# EAGLE design SkyKontrol-watchdog (EAGLE 9.6.2)
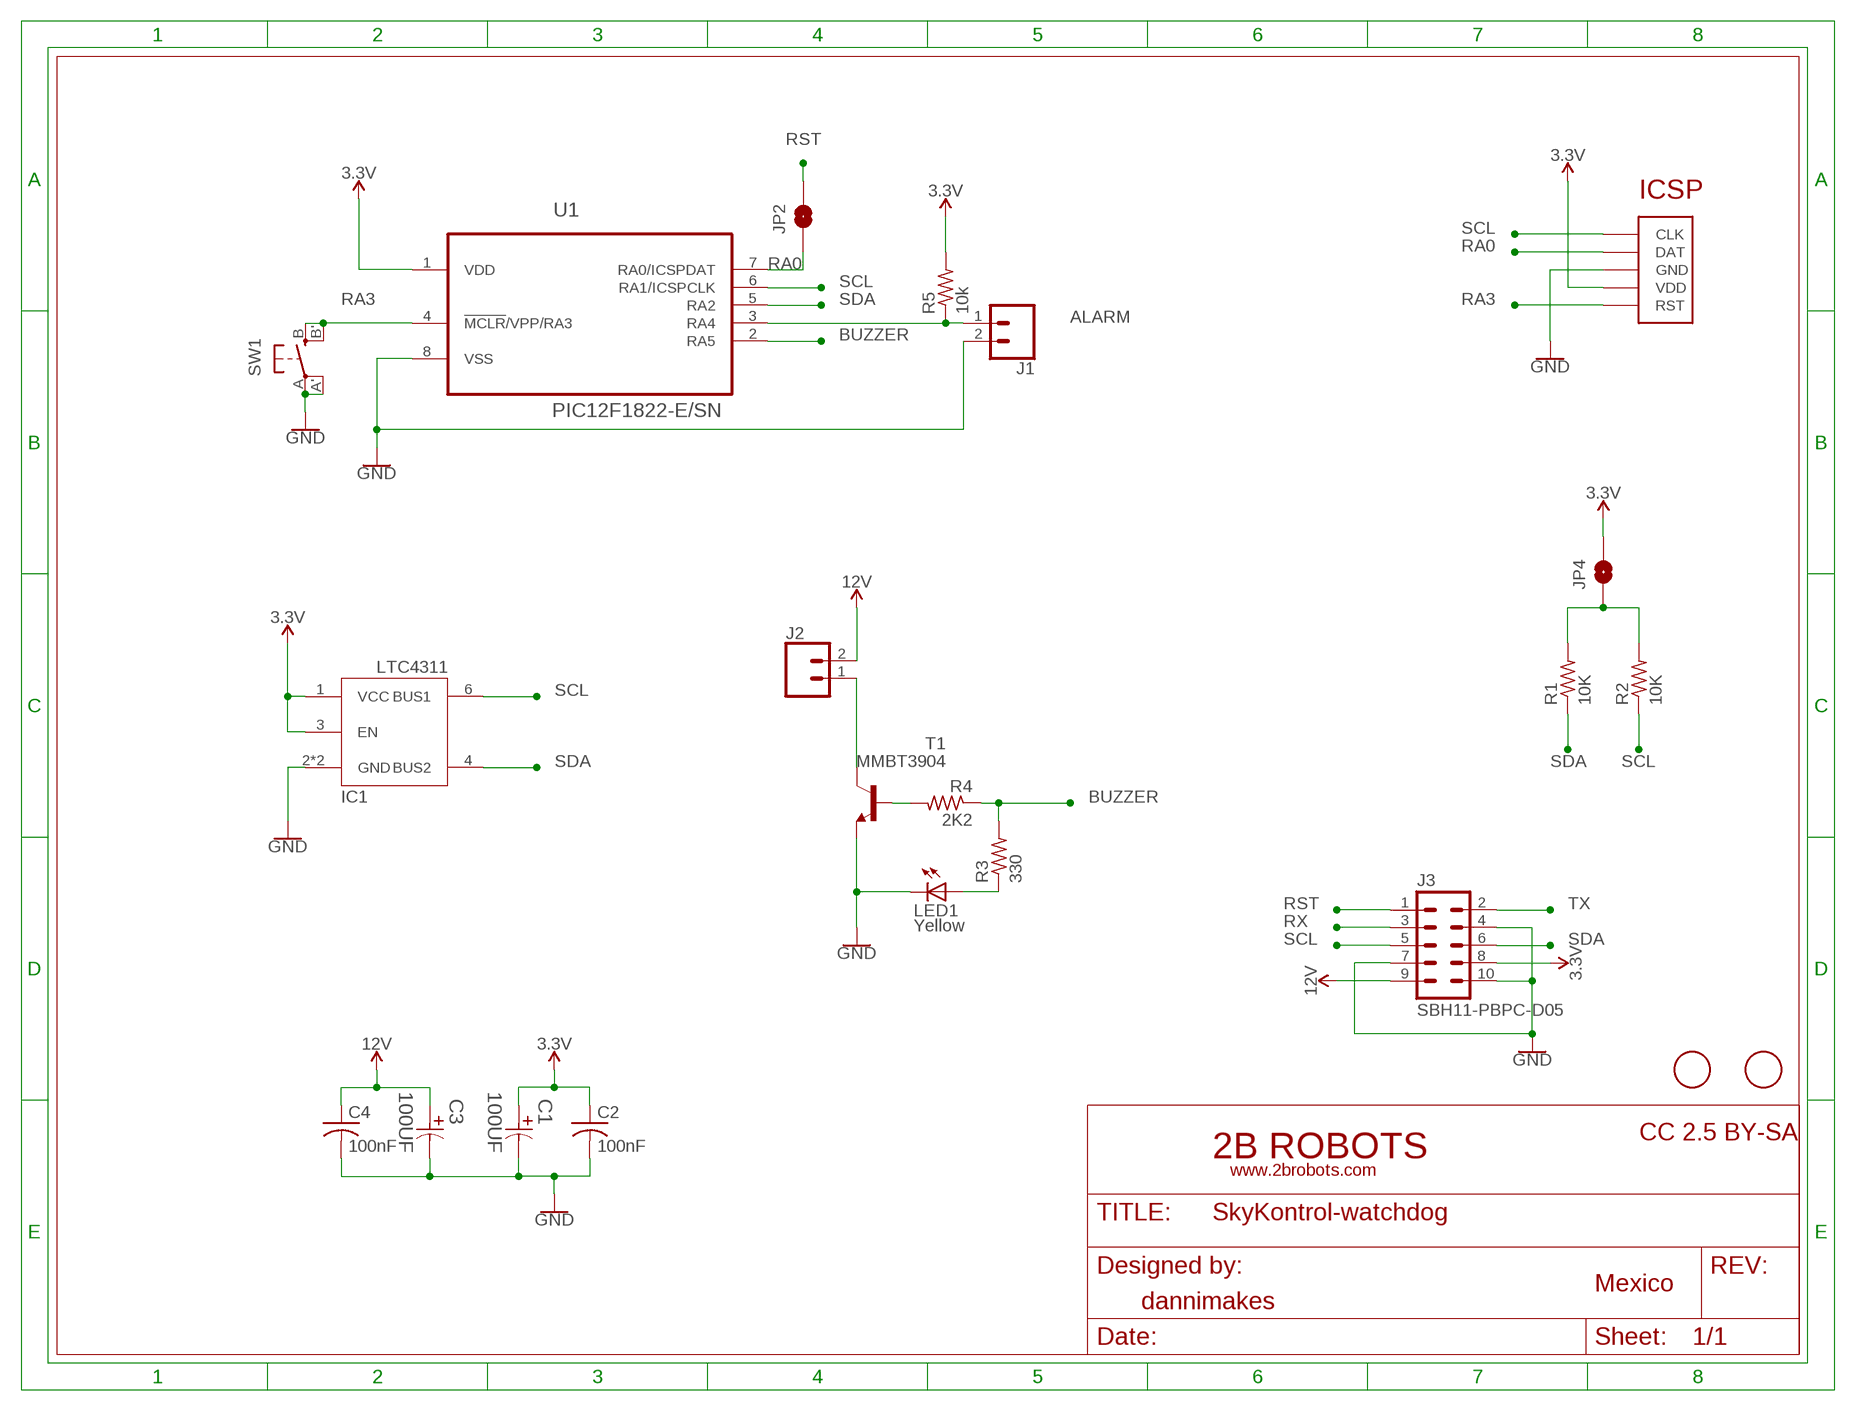
[diagram p0: schematic, sheet 1]

## Parts
C1  100UF  EEE-HA1E101XP-CASE-D8  [CAPAE660X800N]
C2  100nF  C-USC0603K  [C0603K]
C3  100UF  EEE-HA1E101XP-CASE-D8  [CAPAE660X800N]
C4  100nF  C-USC0603K  [C0603K]
IC1  LTC4311_SC70  [SC70-6L]
J1  CONN_025MM  [SCREWTERMINAL-5MM-2]
J2  CONN_025MM  [SCREWTERMINAL-5MM-2]
J3  SBH11-PBPC-D05  [SBH11-PBPC-D05]
JP2  JUMPER-SMT_2_NO_SILK  [SMT-JUMPER_2_NO_SILK]
JP4  JUMPER-SMT_2_NO_SILK  [SMT-JUMPER_2_NO_SILK]
LED1  Yellow  LEDCHIPLED_1206  [CHIPLED_1206]
R1  10K  R-US_R0805  [R0805]
R2  10K  R-US_R0805  [R0805]
R3  330  R-US_R0805  [R0805]
R4  2K2  R-US_R0805  [R0805]
R5  10k  R-US_R0805  [R0805]
SW1  SPST_TACT-EVQQ2  [EVQ-Q2]
T1  MMBT3904  MMBT3904LT1-NPN-SOT23-BEC  [SOT23-BEC]
U1  PIC12F1822-E/SN  [SOIC127P600X175-8N]
U$1  FIDUCIAL  [FIDUCIAL_1MM]
U$2  ICSP_POGO  [ICSP_POGO]
U$3  FIDUCIAL  [FIDUCIAL_1MM]

## Nets
3.3V: C1.1 C2.1 IC1.1(VCC) IC1.3(EN) J3.8 JP4.2 R5.2 U1.1(VDD) U$2.P$2(VDD)
12V: C3.1 C4.1 J2.2 J3.9
ALARM: J1.1 R5.1 U1.3(RA4)
BUZZER: R3.2 R4.1 U1.2(RA5)
GND: C1.2 C2.2 C3.2 C4.2 IC1.2(GND) IC1.5(GND) J1.2 J3.4 J3.7 J3.10 LED1.C SW1.A'(P1) SW1.A(P) T1.E U1.8(VSS) U$2.P$3(GND)
N$1: LED1.A R3.1
N$2: J2.1 T1.C
N$8: JP4.1 R1.2 R2.2
N$12: R4.2 T1.B
RA0: JP2.1 U1.7(RA0/ICSPDAT) U$2.P$4(DAT)
RA3: SW1.B'(S1) SW1.B(S) U1.4(!MCLR!/VPP/RA3) U$2.P$1(RST)
RST: J3.1 JP2.2
RX: J3.3
SCL: IC1.6(BUS1) J3.5 R2.1 U1.6(RA1/ICSPCLK) U$2.P$5(CLK)
SDA: IC1.4(BUS2) J3.6 R1.1 U1.5(RA2)
TX: J3.2

## Library data of the parts
C1 C3 = Panasonic-EEEFT_EEEH:EEE-: Aluminum Electrolytic Capacitors,Surface Mount Type; MPN: EEE-HA1E101XP; OC_FARNELL: 1973328; OC_NEWARK: 58T9236; PACKAGE: CASE-D8; SUPPLIER: PANASONIC; TOLERANCE: ±20 %; VOLTAGERATING: 25V
C2 C4 = adafruit:C-US: CAPACITOR, American symbol
IC1 = LTC4311:LTC4311
J1 J2 = SparkFun-Connectors:CONN_02: Multi connection point. Often used as Generic Header-pin footprint for 0.1 inch spaced/style header connections On any of the 0.1 inch spaced packages, you can populate with these: Break Away Headers - Straight <https://www.sparkfun.com/products/116> (PRT-00116) Break Away Male Headers - Right Angle <https://www.sparkfun.com/products/553> (PRT-00553) Female Headers <https://www.sparkfun.com/products/115> (PRT-00115) Break Away Headers - Machine Pin <https://www.sparkfun.com/products/117> (PRT-00117) Break Away Female Headers - Swiss Machine Pin <https://www.sparkfun.com/products/743> (PRT-00743) For SCREWTERMINALS and SPRING TERMINALS visit here: Screw Terimnals on SparkFun.com <https://www.sparkfun.com/search/results?term=Screw+Terminals> (5mm/3.5mm/2.54mm spacing) This device is also useful as a general connection point to wire up your design to another part of your project. Our various solder wires solder well into these plated through hole pads. Hook-Up Wire - Assortment (Stranded, 22 AWG) <https://www.sparkfun.com/products/11375> (PRT-11375) Hook-Up Wire - Assortment (Solid Core, 22 AWG) <https://www.sparkfun.com/products/11367> (PRT-11367) View the entire wire category on our website here <https://www.sparkfun.com/categories/141> Special notes: Molex polarized connector foot print use with: PRT-08233 with associated crimp pins and housings. 2.54_SCREWTERM for use with PRT-10571. 3.5mm Screw Terminal footprints for PRT-08084 5mm Screw Terminal footprints for use with PRT-08432; SF_SKU: PRT-08432
J3 = con-sullins:SBH11-PBPC-D05: HEADER - Vertical, Shrouded
JP2 JP4 = SparkFun-Jumpers:JUMPER-SMT_2_NO: Normally open jumper This jumper has two pads in close proximity to each other. Apply solder to close the connection. Round pads are easier to solder for beginners, but are a lot larger. SparkFun Product that uses the round pads: SparkFun EL Sequencer <https://www.sparkfun.com/products/12781>
LED1 = adafruit:LED: LED OSRAM: - CHIPLED LG R971, LG N971, LY N971, LG Q971, LY Q971, LO R971, LY R971 LH N974, LH R974 LS Q976, LO Q976, LY Q976 LO Q996 - Hyper CHIPLED LW Q18S LB Q993, LB Q99A, LB R99A - SideLED LS A670, LO A670, LY A670, LG A670, LP A670 LB A673, LV A673, LT A673, LW A673 LH A674 LY A675 LS A676, LA A676, LO A676, LY A676, LW A676 LS A679, LY A679, LG A679 - Hyper Micro SIDELED® LS Y876, LA Y876, LO Y876, LY Y876 LT Y87S - SmartLED LW L88C, LW L88S LB L89C, LB L89S, LG L890 LS L89K, LO L89K, LY L89K LS L896, LA L896, LO L896, LY L896 - TOPLED LS T670, LO T670, LY T670, LG T670, LP T670 LSG T670, LSP T670, LSY T670, LOP T670, LYG T670 LG T671, LOG T671, LSG T671 LB T673, LV T673, LT T673, LW T673 LH T674 LS T676, LA T676, LO T676, LY T676, LB T676, LH T676, LSB T676, LW T676 LB T67C, LV T67C, LT T67C, LS T67K, LO T67K, LY T67K, LW E67C LS E67B, LA E67B, LO E67B, LY E67B, LB E67C, LV E67C, LT E67C LW T67C LS T679, LY T679, LG T679 LS T770, LO T770, LY T770, LG T770, LP T770 LB T773, LV T773, LT T773, LW T773 LH T774 LS E675, LA E675, LY E675, LS T675 LS T776, LA T776, LO T776, LY T776, LB T776 LHGB T686 LT T68C, LB T68C - Hyper Mini TOPLED® LB M676 - Mini TOPLED Santana® LG M470 LS M47K, LO M47K, LY M47K Source: http://www.osram.convergy.de/
R1-R5 = adafruit:R-US_: RESISTOR, American symbol
SW1 = adafruit:SPST_TACT: SMT 6mm switch, EVQQ2 series http://www.ladyada.net/library/eagle
T1 = transistor:*-NPN-: NPN Transistror BF959 corrected 2008.03.06
U1 = Microchip-PIC12F1822-E_SN:PIC12F1822-E/SN: 8/14-Pin Flash Microcontrollers,SOIC-8; MPN: PIC12F1822-E/SN; OC_FARNELL: 2315760; OC_NEWARK: 53R0195; PACKAGE: SOIC-8; SUPPLIER: Microchip
U$1 U$3 = adafruit:FIDUCIAL: For use by pick and place machines to calibrate the vision/machine, 1mm By microbuilder.eu
U$2 = ICSP_POGO:ICSP_POGO

## Board
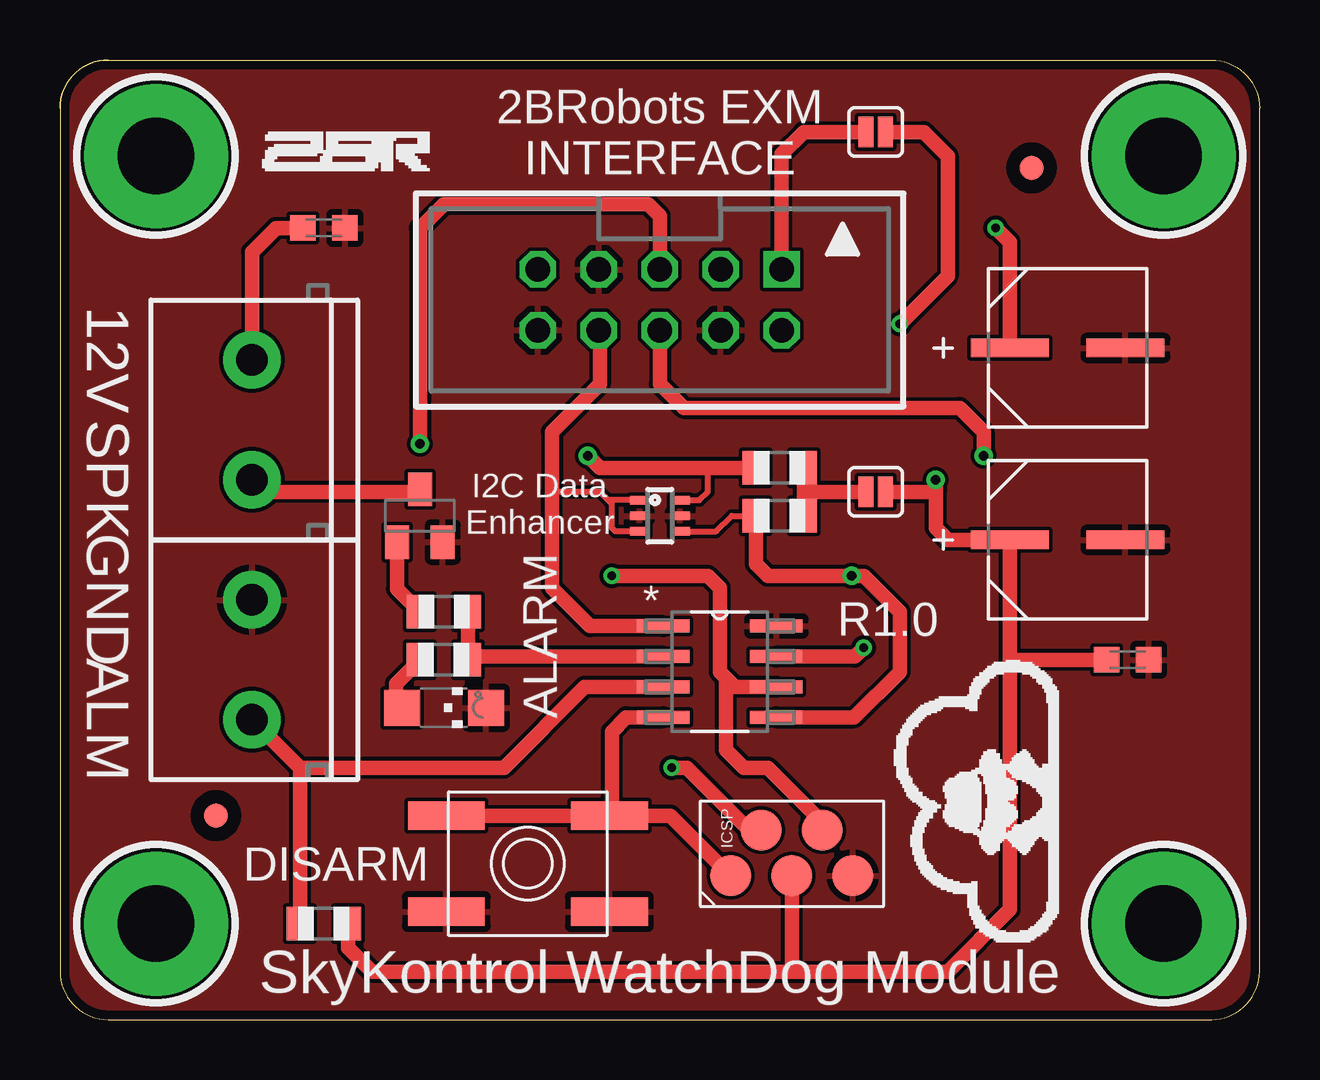
[diagram p1: board, top side]
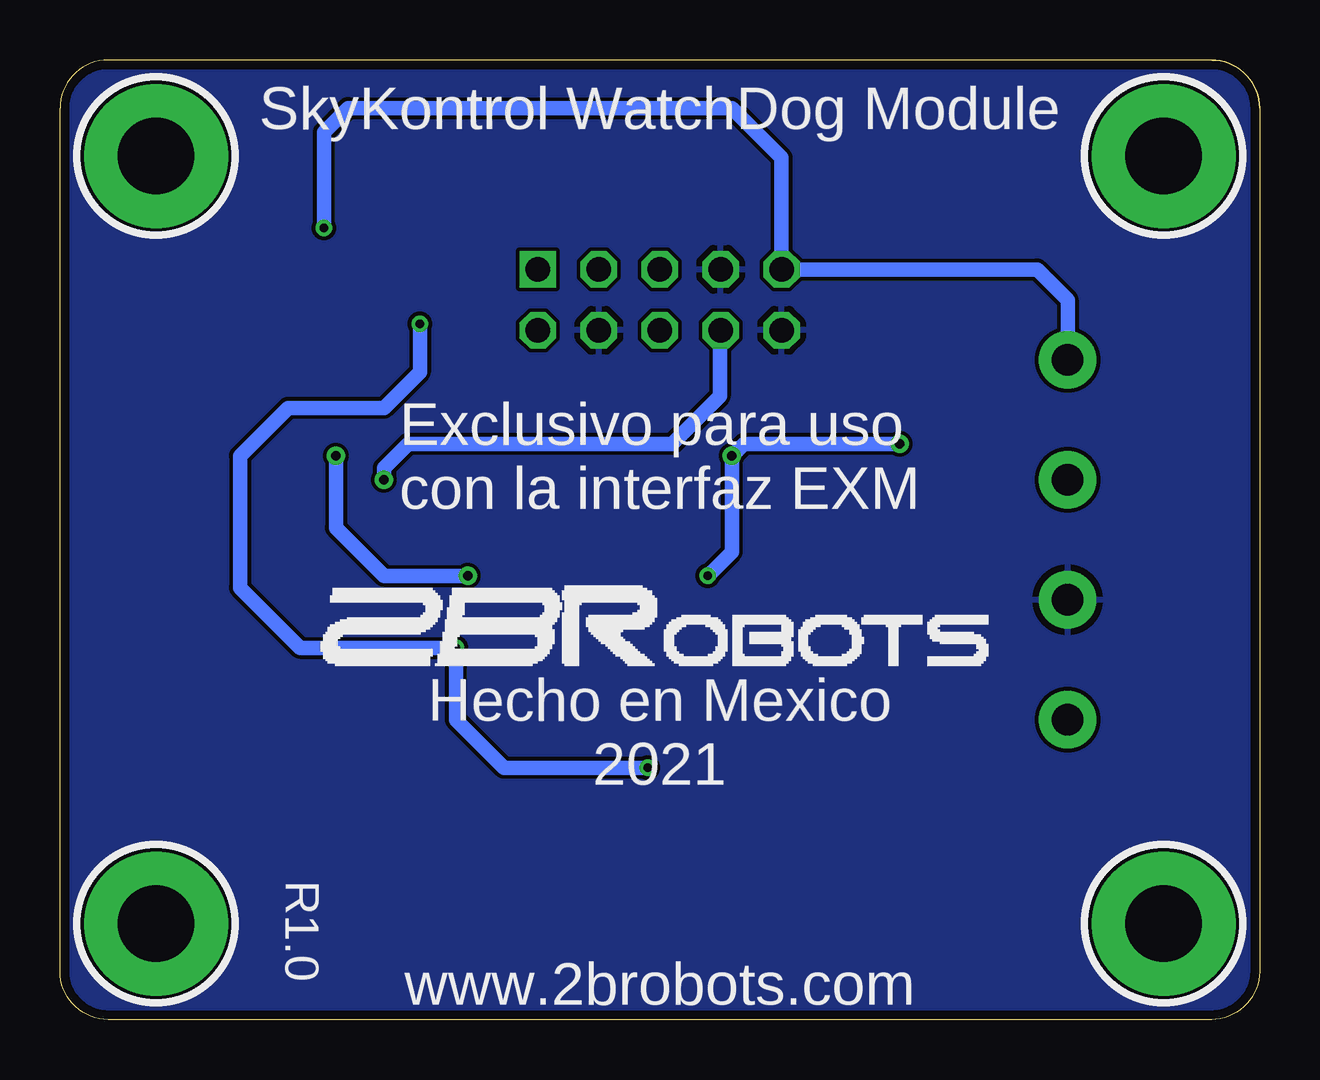
[diagram p2: board, bottom side, seen from below]

Size 50 x 40 mm. Coordinates in mm from the lower left corner, seen from the top.
Outline: 0,38 0,2 arc90 2,0 48,0 arc90 50,2 50,38 arc90 48,40 2,40
Outline: 2,40 arc90 0,38
Outline: 0,38 arc-90 2,40
Copper layers (1*16): Top 0.0356mm / dielectric 1.5011mm / Bottom 0.0356mm
Design rules "2brobots-2layer": minimum track width 6mil, minimum drill 0.3mm, track to track 6mil, track to pad 6mil, pad to pad 6mil, via to via 6mil, smd to smd 6mil, copper to edge 15mil, drill to drill 6mil, minimum pad ring 7mil, minimum via ring 7mil, stop-mask expansion 2.5mil, vias tented up to drill 50mil, thermal gap 10mil

### Footprints (pad centres in the part's own frame; a part is rotated, then mirrored left to right if it is on the bottom)
CAPAE660X800N = smd 3.251 x 0.762: 1 -2.413,0; 2 2.413,0
C0603K = smd 1.05 x 1.08: 1 -0.875,0; 2 0.875,0
SC70-6L = smd 0.35 x 0.8: 1 -0.65,-0.85; 2 0,-0.85; 3 0.65,-0.85; 4 0.65,0.85; 5 0,0.85; 6 -0.65,0.85
SCREWTERMINAL-5MM-2 = drill 1.3 pad 2.413: 1 -2.5,0; 2 2.5,0
SBH11-PBPC-D05 = drill 1.016 square: 1 -5.08,-1.27 | drill 1.016 octagon: 2 -5.08,1.27; 3 -2.54,-1.27; 4 -2.54,1.27; 5 0,-1.27; 6 0,1.27; 7 2.54,-1.27; 8 2.54,1.27; 9 5.08,-1.27; 10 5.08,1.27
SMT-JUMPER_2_NO_SILK = smd 0.635 x 1.27: 1 -0.406,0; 2 0.406,0
CHIPLED_1206 = smd 1.5 x 1.5: A 0,-1.75; C 0,1.75
R0805 = smd 1.1 x 1.4: 1 -1,0; 2 1,0
EVQ-Q2 = smd 3.2 x 1.2: A -3.4,-2; A' 3.4,-2; B -3.4,2; B' 3.4,2
SOT23-BEC = smd 1 x 1.4: B -0.95,-1.1; C 0,1.1; E 0.95,-1.1
SOIC127P600X175-8N = smd 2.184 x 0.559: 1 -2.362,1.905; 2 -2.362,0.635; 3 -2.362,-0.635; 4 -2.362,-1.905; 5 2.362,-1.905; 6 2.362,-0.635; 7 2.362,0.635; 8 2.362,1.905
FIDUCIAL_1MM = smd 1 x 1: 1 0,0
ICSP_POGO = smd 1.7 x 1.7: P$1 -2.55,0; P$2 0,0; P$3 2.55,0; P$4 -1.275,1.9; P$5 1.275,1.9

### Placement (x,y rotation side)
C1  42,20 0 top
C2  44.5,15 0 top
C3  42,28 0 top
C4  11,33 0 top
IC1  25,21 270 top
J1  8,15 90 top
J2  8,25 90 top
J3  25,30 180 top
JP2  34,37 180 top
JP4  34,22 0 top
LED1  16,13 270 top
R1  30,21 0 top
R2  30,23 0 top
R3  16,15 0 top
R4  16,17 180 top
R5  11,4 0 top
SW1  19.5,6.5 0 top
T1  15,21 0 top
U1  27.5,14.5 0 top
U$1  6.5,8.5 0 top
U$2  30.5,6 0 top
U$3  40.5,35.5 0 top

### Tracks (layer width: path | path; a pad name or v marks a point on that pad's centre or on a via)
3.3V  (via drill 0.4)
  Top 0.254: IC1.3 23.15,20.35 23,20.5 23,21.5 22.85,21.65 | 22.85,21.65 22.5,22 20.5,22 | IC1.1 22.85,21.65
  Top 0.61: J3.8 22.5,28.69 22.5,26.5 20.5,24.5 20.5,22 20.5,18 22.09,16.41 U1.1 | v36.5,22.5 36.5,22 | C2.1 39.59,15 | 39.59,15 C1.1 37,20 36.5,20.5 36.5,22 | R5.2 12,3 13,2 30.5,2 | 30.5,2 U$2.P$2 | JP4.2 36.5,22 | 30.5,2 37,2 39.59,4.59 39.59,15
  Bottom 0.61: J3.8 22.5,28.69 22.5,26 24.5,24 35.5,24 36.5,23 v36.5,22.5
12V  (via drill 0.35)
  Top 0.61: C4.1 9,33 8,32 J2.2 | C3.1 39.59,32.41 v39,33
  Bottom 0.61: J2.2 8,30 9.27,31.27 J3.9 19.92,35.92 22,38 38,38 39,37 v39,33
ALARM
  Top 0.61: R5.1 10,10.5 | 10,10.5 J1.1 | U1.3 21.86,13.87 18.5,10.5 10,10.5
BUZZER
  Top 0.61: R4.1 R3.2 17.14,15.13 U1.2
GND
  pour Top: 0,0 50,0 50,40 0,40
  pour Bottom: 0,0 50,0 50,40 0,40
N$1
  Top 0.61: R3.1 14,14 14,13.25 LED1.A
N$2
  Top 0.61: T1.C 14.9,22 8.5,22 J2.1
N$5  (via drill 3.2 pad 6)
  other vias: 46,36
N$6  (via drill 3.2 pad 6)
  other vias: 4,36
N$7  (via drill 3.2 pad 6)
  other vias: 4,4
N$8
  Top 0.61: R2.2 31,22 | 31,22 R1.2 | JP4.1 31,22
N$11  (via drill 3.2 pad 6)
  other vias: 46,4
N$12
  Top 0.61: T1.B 14.05,17.95 R4.2
RA0  (via drill 0.35)
  Top 0.61: JP2.1 36,37 37,36 37,31 v35,29 | v33.5,15.5 33.13,15.13 U1.7 | U$2.P$4 28.73,7.9 26.12,10.5 v25.5,10.5
  Bottom 0.61: v35,29 35,27 36.5,25.5 40.5,25.5 42.5,23.5 42.5,18 40,15.5 v33.5,15.5 33.5,12.5 31.5,10.5 v25.5,10.5
RA3
  Top 0.61: SW1.B SW1.B' | U$2.P$1 25.45,8.5 SW1.B' | SW1.B' 23,8.6 23,12 23.59,12.6 U1.4
RST
  Top 0.61: J3.1 30.08,36.08 31,37 JP2.2
SCL  (via drill 0.35, 0.4)
  Top 0.254: IC1.6 26.65,21.65 27,22 27,23
  Top 0.61: J3.5 25,33.5 24.5,34 16,34 15,33 v15,24 | R2.1 27,23 22.5,23 v22,23.5 | U1.6 28.14,13.87 27.75,14.25 | 27.75,14.25 27.5,14.5 27.5,18 27,18.5 v23,18.5 | U$2.P$5 31.77,8.22 29.5,10.5 28.5,10.5 27.75,11.25 27.75,14.25
  Bottom 0.61: v15,24 21.5,24 v22,23.5 22,19.5 v23,18.5
SDA  (via drill 0.4)
  Top 0.254: IC1.4 27.35,20.35 28,21 R1.1
  Top 0.61: J3.6 25,26.5 26,25.5 37.5,25.5 38.5,24.5 v38.5,23.5 | R1.1 29,19 29.5,18.5 v33,18.5 33.5,18.5 35,17 35,14.5 33.09,12.6 U1.5
  Bottom 0.61: v38.5,23.5 38.5,20.5 36.5,18.5 v33,18.5

### Text on the board
tPlace: 2BRobots EXM / INTERFACE | 12V | SPK | I2C Data / Enhancer | GND | R1.0 | ALARM | ALM | DISARM | SkyKontrol WatchDog Module
bPlace: SkyKontrol WatchDog Module | Exclusivo para uso / con la interfaz EXM | Hecho en Mexico / 2021 | R1.0 | www.2brobots.com
tStop: www.2brobots.com